# EAGLE schematic DIY_Keyboard_V1.2 (EAGLE 9.4.2)
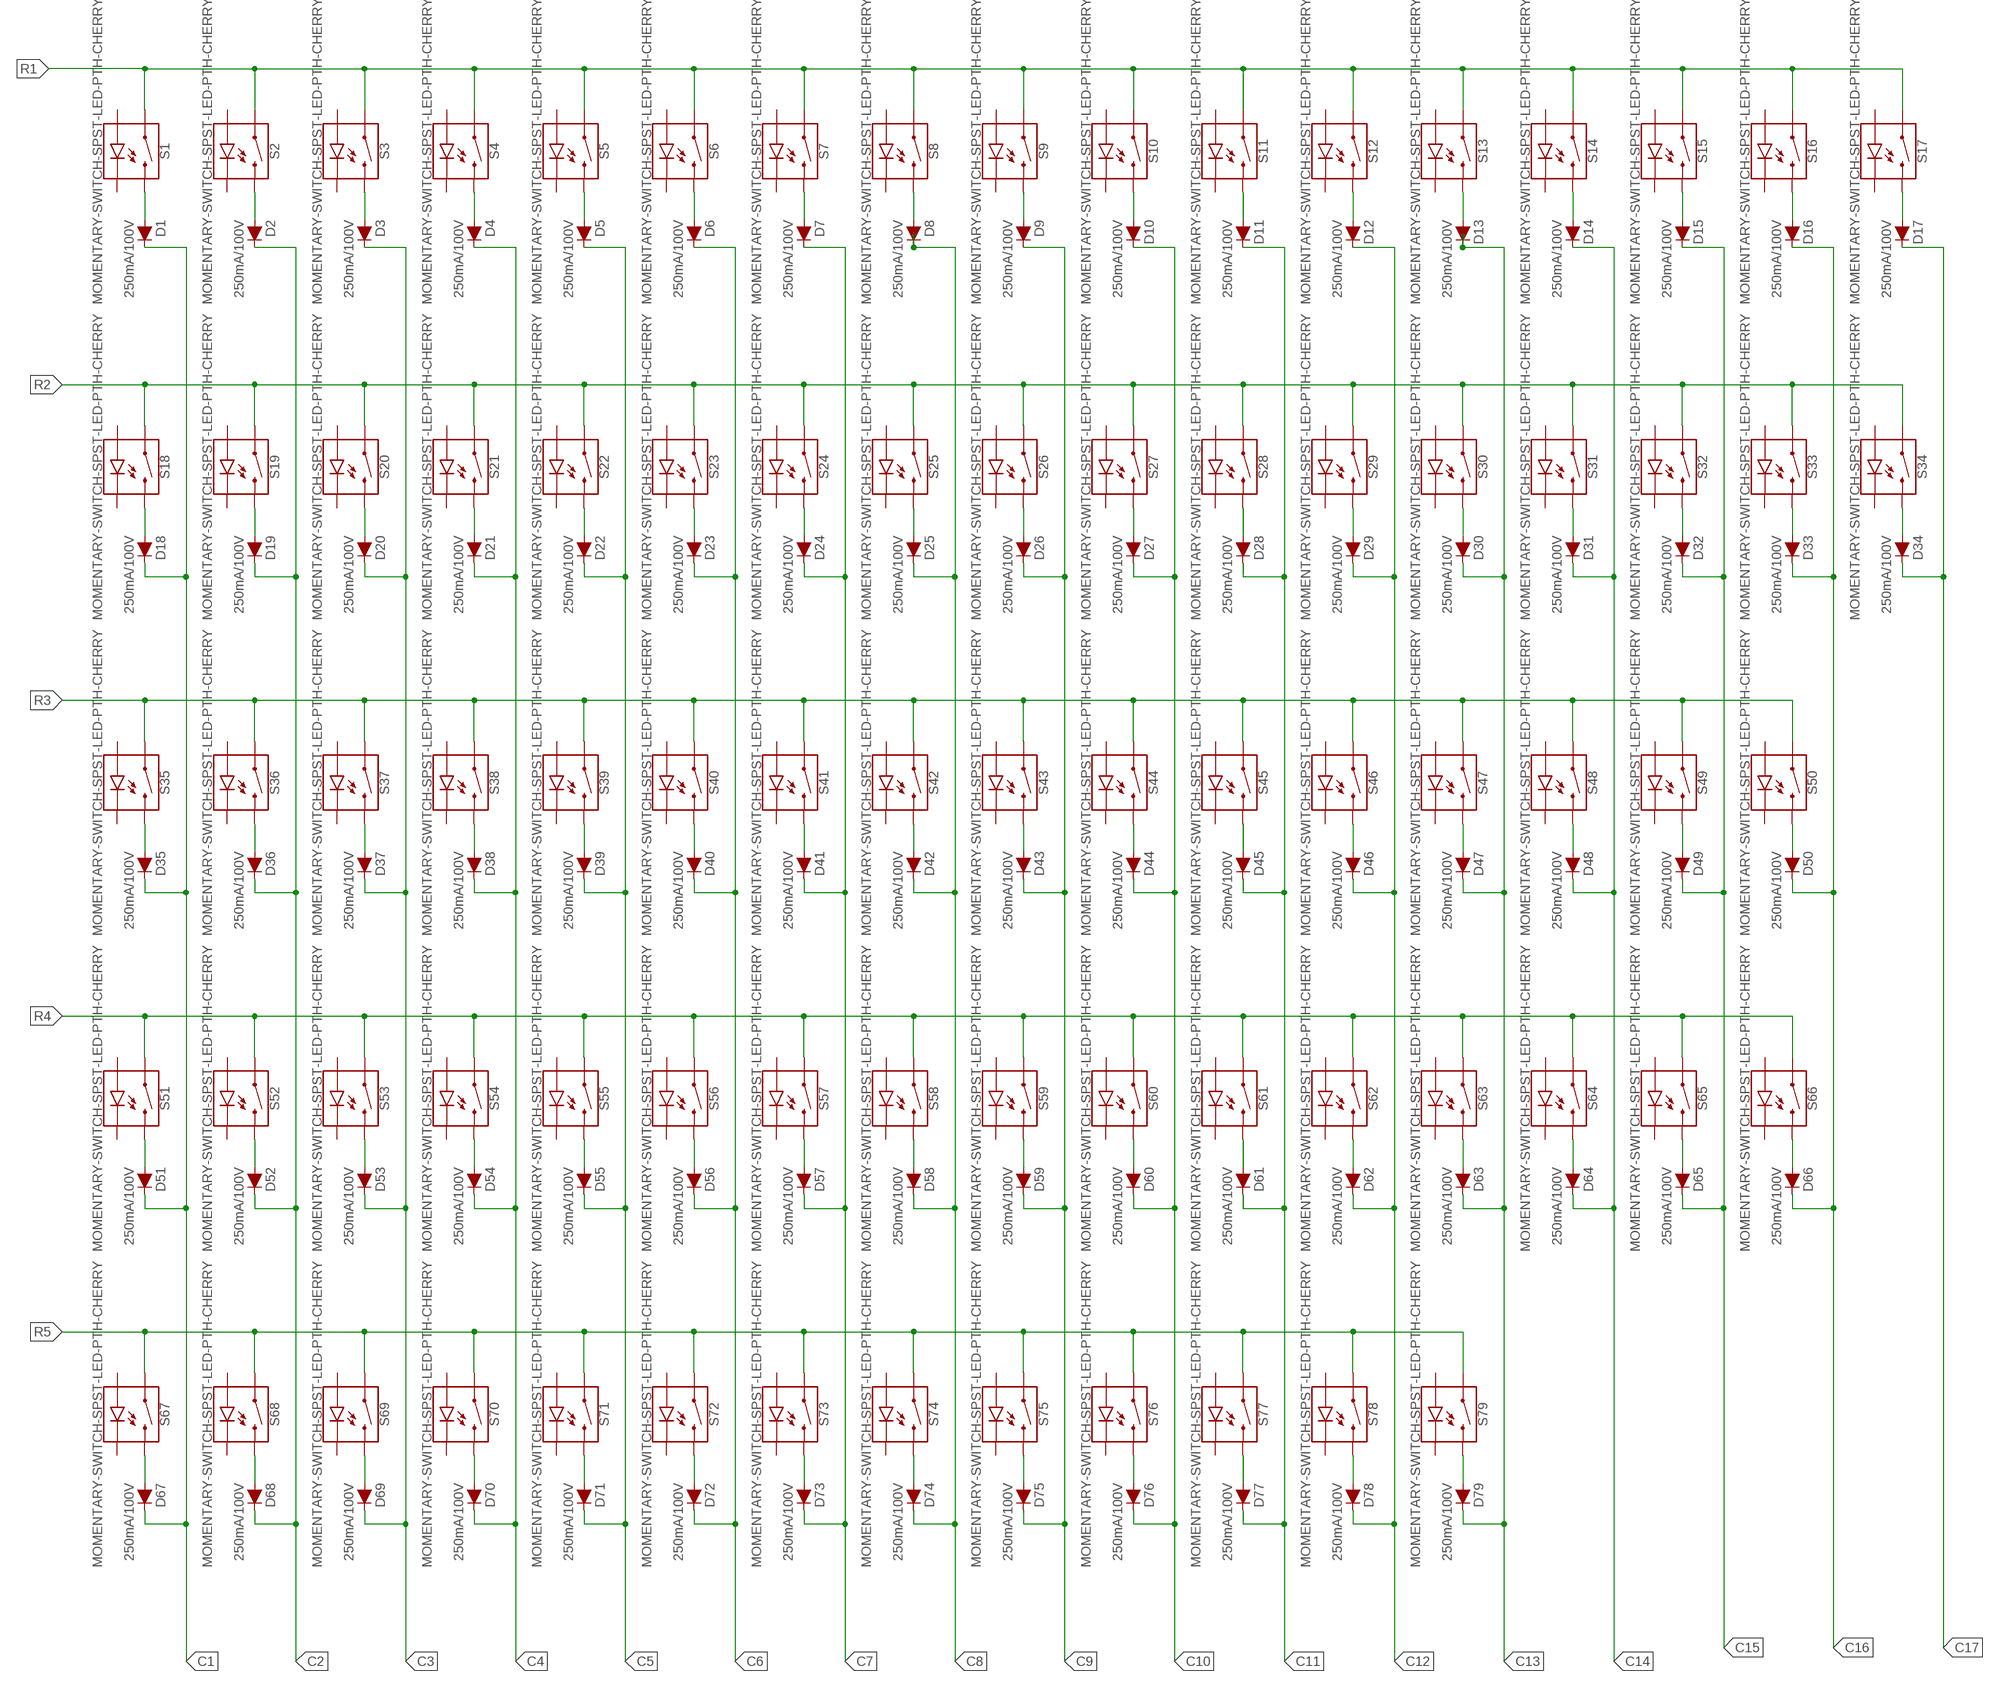
[diagram p0: schematic, sheet 1, part 1 of 2]
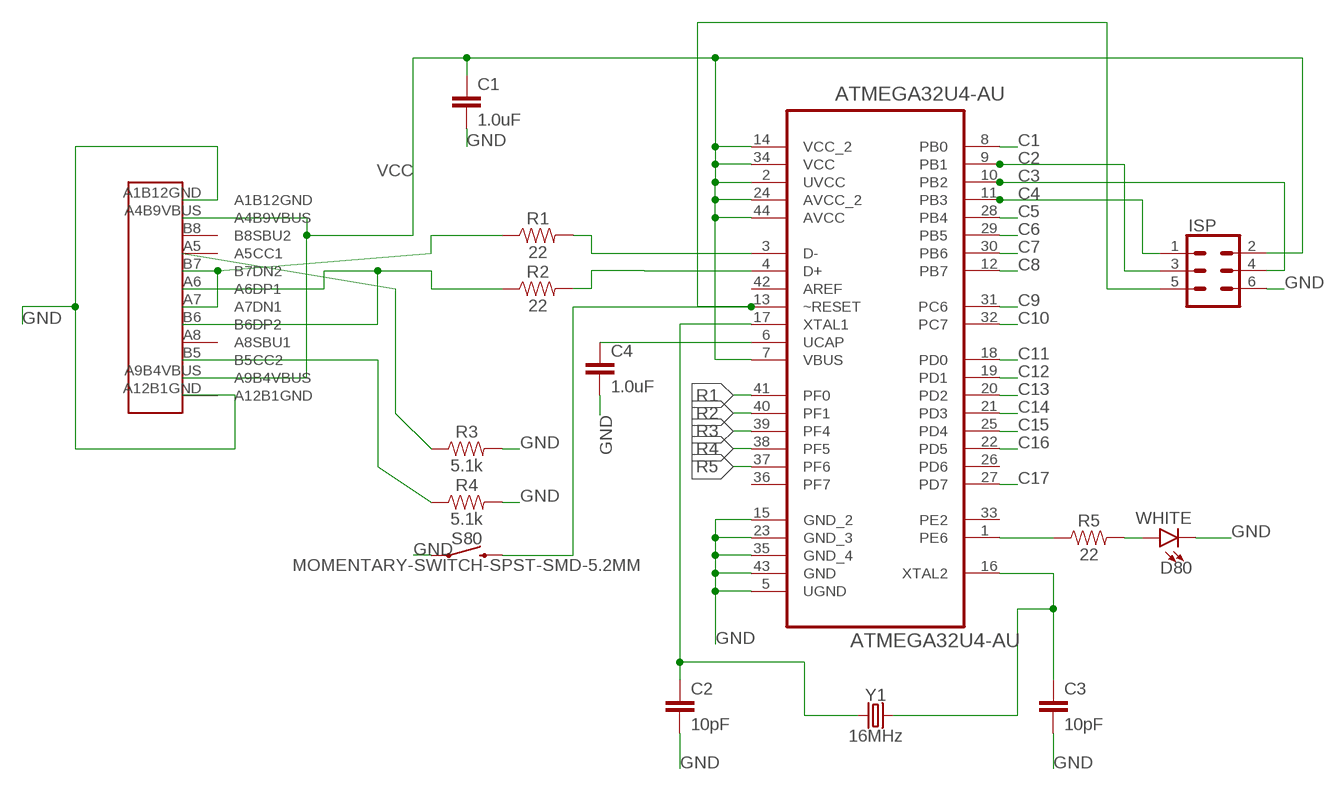
[diagram p1: schematic, sheet 1, part 2 of 2]

## Parts
ATMEGA32U4-AU  ATMEGA32U4-AU  [QFP80P1200X1200X120-44N]
C1  1.0uF  1.0UF-0603-16V-10%  [0603]
C2  10pF  10PF-0603-50V-5%  [0603]
C3  10pF  10PF-0603-50V-5%  [0603]
C4  1.0uF  1.0UF-0603-16V-10%  [0603]
D1  250mA/100V  DIODE-BAS16J  [SOD-323]
D2  250mA/100V  DIODE-BAS16J  [SOD-323]
D3  250mA/100V  DIODE-BAS16J  [SOD-323]
D4  250mA/100V  DIODE-BAS16J  [SOD-323]
D5  250mA/100V  DIODE-BAS16J  [SOD-323]
D6  250mA/100V  DIODE-BAS16J  [SOD-323]
D7  250mA/100V  DIODE-BAS16J  [SOD-323]
D8  250mA/100V  DIODE-BAS16J  [SOD-323]
D9  250mA/100V  DIODE-BAS16J  [SOD-323]
D10  250mA/100V  DIODE-BAS16J  [SOD-323]
D11  250mA/100V  DIODE-BAS16J  [SOD-323]
D12  250mA/100V  DIODE-BAS16J  [SOD-323]
D13  250mA/100V  DIODE-BAS16J  [SOD-323]
D14  250mA/100V  DIODE-BAS16J  [SOD-323]
D15  250mA/100V  DIODE-BAS16J  [SOD-323]
D16  250mA/100V  DIODE-BAS16J  [SOD-323]
D17  250mA/100V  DIODE-BAS16J  [SOD-323]
D18  250mA/100V  DIODE-BAS16J  [SOD-323]
D19  250mA/100V  DIODE-BAS16J  [SOD-323]
D20  250mA/100V  DIODE-BAS16J  [SOD-323]
D21  250mA/100V  DIODE-BAS16J  [SOD-323]
D22  250mA/100V  DIODE-BAS16J  [SOD-323]
D23  250mA/100V  DIODE-BAS16J  [SOD-323]
D24  250mA/100V  DIODE-BAS16J  [SOD-323]
D25  250mA/100V  DIODE-BAS16J  [SOD-323]
D26  250mA/100V  DIODE-BAS16J  [SOD-323]
D27  250mA/100V  DIODE-BAS16J  [SOD-323]
D28  250mA/100V  DIODE-BAS16J  [SOD-323]
D29  250mA/100V  DIODE-BAS16J  [SOD-323]
D30  250mA/100V  DIODE-BAS16J  [SOD-323]
D31  250mA/100V  DIODE-BAS16J  [SOD-323]
D32  250mA/100V  DIODE-BAS16J  [SOD-323]
D33  250mA/100V  DIODE-BAS16J  [SOD-323]
D34  250mA/100V  DIODE-BAS16J  [SOD-323]
D35  250mA/100V  DIODE-BAS16J  [SOD-323]
D36  250mA/100V  DIODE-BAS16J  [SOD-323]
D37  250mA/100V  DIODE-BAS16J  [SOD-323]
D38  250mA/100V  DIODE-BAS16J  [SOD-323]
D39  250mA/100V  DIODE-BAS16J  [SOD-323]
D40  250mA/100V  DIODE-BAS16J  [SOD-323]
D41  250mA/100V  DIODE-BAS16J  [SOD-323]
D42  250mA/100V  DIODE-BAS16J  [SOD-323]
D43  250mA/100V  DIODE-BAS16J  [SOD-323]
D44  250mA/100V  DIODE-BAS16J  [SOD-323]
D45  250mA/100V  DIODE-BAS16J  [SOD-323]
D46  250mA/100V  DIODE-BAS16J  [SOD-323]
D47  250mA/100V  DIODE-BAS16J  [SOD-323]
D48  250mA/100V  DIODE-BAS16J  [SOD-323]
D49  250mA/100V  DIODE-BAS16J  [SOD-323]
D50  250mA/100V  DIODE-BAS16J  [SOD-323]
D51  250mA/100V  DIODE-BAS16J  [SOD-323]
D52  250mA/100V  DIODE-BAS16J  [SOD-323]
D53  250mA/100V  DIODE-BAS16J  [SOD-323]
D54  250mA/100V  DIODE-BAS16J  [SOD-323]
D55  250mA/100V  DIODE-BAS16J  [SOD-323]
D56  250mA/100V  DIODE-BAS16J  [SOD-323]
D57  250mA/100V  DIODE-BAS16J  [SOD-323]
D58  250mA/100V  DIODE-BAS16J  [SOD-323]
D59  250mA/100V  DIODE-BAS16J  [SOD-323]
D60  250mA/100V  DIODE-BAS16J  [SOD-323]
D61  250mA/100V  DIODE-BAS16J  [SOD-323]
D62  250mA/100V  DIODE-BAS16J  [SOD-323]
D63  250mA/100V  DIODE-BAS16J  [SOD-323]
D64  250mA/100V  DIODE-BAS16J  [SOD-323]
D65  250mA/100V  DIODE-BAS16J  [SOD-323]
D66  250mA/100V  DIODE-BAS16J  [SOD-323]
D67  250mA/100V  DIODE-BAS16J  [SOD-323]
D68  250mA/100V  DIODE-BAS16J  [SOD-323]
D69  250mA/100V  DIODE-BAS16J  [SOD-323]
D70  250mA/100V  DIODE-BAS16J  [SOD-323]
D71  250mA/100V  DIODE-BAS16J  [SOD-323]
D72  250mA/100V  DIODE-BAS16J  [SOD-323]
D73  250mA/100V  DIODE-BAS16J  [SOD-323]
D74  250mA/100V  DIODE-BAS16J  [SOD-323]
D75  250mA/100V  DIODE-BAS16J  [SOD-323]
D76  250mA/100V  DIODE-BAS16J  [SOD-323]
D77  250mA/100V  DIODE-BAS16J  [SOD-323]
D78  250mA/100V  DIODE-BAS16J  [SOD-323]
D79  250mA/100V  DIODE-BAS16J  [SOD-323]
D80  WHITE  LED-WHITE0603  [LED-0603]
ISP  CONN_03X2FEMALE  [2X3]
R1  22  22OHM-0603-1/10W-1%  [0603]
R2  22  22OHM-0603-1/10W-1%  [0603]
R3  5.1k  56KOHM  [0603]
R4  5.1k  56KOHM  [0603]
R5  22  22OHM-0603-1/10W-1%  [0603]
S1  MOMENTARY-SWITCH-SPST-LED-PTH-CHERRY  [CHERRY-MX-LED]
S2  MOMENTARY-SWITCH-SPST-LED-PTH-CHERRY  [CHERRY-MX-LED]
S3  MOMENTARY-SWITCH-SPST-LED-PTH-CHERRY  [CHERRY-MX-LED]
S4  MOMENTARY-SWITCH-SPST-LED-PTH-CHERRY  [CHERRY-MX-LED]
S5  MOMENTARY-SWITCH-SPST-LED-PTH-CHERRY  [CHERRY-MX-LED]
S6  MOMENTARY-SWITCH-SPST-LED-PTH-CHERRY  [CHERRY-MX-LED]
S7  MOMENTARY-SWITCH-SPST-LED-PTH-CHERRY  [CHERRY-MX-LED]
S8  MOMENTARY-SWITCH-SPST-LED-PTH-CHERRY  [CHERRY-MX-LED]
S9  MOMENTARY-SWITCH-SPST-LED-PTH-CHERRY  [CHERRY-MX-LED]
S10  MOMENTARY-SWITCH-SPST-LED-PTH-CHERRY  [CHERRY-MX-LED]
S11  MOMENTARY-SWITCH-SPST-LED-PTH-CHERRY  [CHERRY-MX-LED]
S12  MOMENTARY-SWITCH-SPST-LED-PTH-CHERRY  [CHERRY-MX-LED]
S13  MOMENTARY-SWITCH-SPST-LED-PTH-CHERRY  [CHERRY-MX-LED]
S14  MOMENTARY-SWITCH-SPST-LED-PTH-CHERRY  [CHERRY-MX-LED]
S15  MOMENTARY-SWITCH-SPST-LED-PTH-CHERRY  [CHERRY-MX-LED]
S16  MOMENTARY-SWITCH-SPST-LED-PTH-CHERRY  [CHERRY-MX-LED]
S17  MOMENTARY-SWITCH-SPST-LED-PTH-CHERRY  [CHERRY-MX-LED]
S18  MOMENTARY-SWITCH-SPST-LED-PTH-CHERRY  [CHERRY-MX-LED]
S19  MOMENTARY-SWITCH-SPST-LED-PTH-CHERRY  [CHERRY-MX-LED]
S20  MOMENTARY-SWITCH-SPST-LED-PTH-CHERRY  [CHERRY-MX-LED]
S21  MOMENTARY-SWITCH-SPST-LED-PTH-CHERRY  [CHERRY-MX-LED]
S22  MOMENTARY-SWITCH-SPST-LED-PTH-CHERRY  [CHERRY-MX-LED]
S23  MOMENTARY-SWITCH-SPST-LED-PTH-CHERRY  [CHERRY-MX-LED]
S24  MOMENTARY-SWITCH-SPST-LED-PTH-CHERRY  [CHERRY-MX-LED]
S25  MOMENTARY-SWITCH-SPST-LED-PTH-CHERRY  [CHERRY-MX-LED]
S26  MOMENTARY-SWITCH-SPST-LED-PTH-CHERRY  [CHERRY-MX-LED]
S27  MOMENTARY-SWITCH-SPST-LED-PTH-CHERRY  [CHERRY-MX-LED]
S28  MOMENTARY-SWITCH-SPST-LED-PTH-CHERRY  [CHERRY-MX-LED]
S29  MOMENTARY-SWITCH-SPST-LED-PTH-CHERRY  [CHERRY-MX-LED]
S30  MOMENTARY-SWITCH-SPST-LED-PTH-CHERRY  [CHERRY-MX-LED]
S31  MOMENTARY-SWITCH-SPST-LED-PTH-CHERRY  [CHERRY-MX-LED]
S32  MOMENTARY-SWITCH-SPST-LED-PTH-CHERRY  [CHERRY-MX-LED]
S33  MOMENTARY-SWITCH-SPST-LED-PTH-CHERRY  [CHERRY-MX-LED]
S34  MOMENTARY-SWITCH-SPST-LED-PTH-CHERRY  [CHERRY-MX-LED]
S35  MOMENTARY-SWITCH-SPST-LED-PTH-CHERRY  [CHERRY-MX-LED]
S36  MOMENTARY-SWITCH-SPST-LED-PTH-CHERRY  [CHERRY-MX-LED]
S37  MOMENTARY-SWITCH-SPST-LED-PTH-CHERRY  [CHERRY-MX-LED]
S38  MOMENTARY-SWITCH-SPST-LED-PTH-CHERRY  [CHERRY-MX-LED]
S39  MOMENTARY-SWITCH-SPST-LED-PTH-CHERRY  [CHERRY-MX-LED]
S40  MOMENTARY-SWITCH-SPST-LED-PTH-CHERRY  [CHERRY-MX-LED]
S41  MOMENTARY-SWITCH-SPST-LED-PTH-CHERRY  [CHERRY-MX-LED]
S42  MOMENTARY-SWITCH-SPST-LED-PTH-CHERRY  [CHERRY-MX-LED]
S43  MOMENTARY-SWITCH-SPST-LED-PTH-CHERRY  [CHERRY-MX-LED]
S44  MOMENTARY-SWITCH-SPST-LED-PTH-CHERRY  [CHERRY-MX-LED]
S45  MOMENTARY-SWITCH-SPST-LED-PTH-CHERRY  [CHERRY-MX-LED]
S46  MOMENTARY-SWITCH-SPST-LED-PTH-CHERRY  [CHERRY-MX-LED]
S47  MOMENTARY-SWITCH-SPST-LED-PTH-CHERRY  [CHERRY-MX-LED]
S48  MOMENTARY-SWITCH-SPST-LED-PTH-CHERRY  [CHERRY-MX-LED]
S49  MOMENTARY-SWITCH-SPST-LED-PTH-CHERRY  [CHERRY-MX-LED]
S50  MOMENTARY-SWITCH-SPST-LED-PTH-CHERRY  [CHERRY-MX-LED]
S51  MOMENTARY-SWITCH-SPST-LED-PTH-CHERRY  [CHERRY-MX-LED]
S52  MOMENTARY-SWITCH-SPST-LED-PTH-CHERRY  [CHERRY-MX-LED]
S53  MOMENTARY-SWITCH-SPST-LED-PTH-CHERRY  [CHERRY-MX-LED]
S54  MOMENTARY-SWITCH-SPST-LED-PTH-CHERRY  [CHERRY-MX-LED]
S55  MOMENTARY-SWITCH-SPST-LED-PTH-CHERRY  [CHERRY-MX-LED]
S56  MOMENTARY-SWITCH-SPST-LED-PTH-CHERRY  [CHERRY-MX-LED]
S57  MOMENTARY-SWITCH-SPST-LED-PTH-CHERRY  [CHERRY-MX-LED]
S58  MOMENTARY-SWITCH-SPST-LED-PTH-CHERRY  [CHERRY-MX-LED]
S59  MOMENTARY-SWITCH-SPST-LED-PTH-CHERRY  [CHERRY-MX-LED]
S60  MOMENTARY-SWITCH-SPST-LED-PTH-CHERRY  [CHERRY-MX-LED]
S61  MOMENTARY-SWITCH-SPST-LED-PTH-CHERRY  [CHERRY-MX-LED]
S62  MOMENTARY-SWITCH-SPST-LED-PTH-CHERRY  [CHERRY-MX-LED]
S63  MOMENTARY-SWITCH-SPST-LED-PTH-CHERRY  [CHERRY-MX-LED]
S64  MOMENTARY-SWITCH-SPST-LED-PTH-CHERRY  [CHERRY-MX-LED]
S65  MOMENTARY-SWITCH-SPST-LED-PTH-CHERRY  [CHERRY-MX-LED]
S66  MOMENTARY-SWITCH-SPST-LED-PTH-CHERRY  [CHERRY-MX-LED]
S67  MOMENTARY-SWITCH-SPST-LED-PTH-CHERRY  [CHERRY-MX-LED]
S68  MOMENTARY-SWITCH-SPST-LED-PTH-CHERRY  [CHERRY-MX-LED]
S69  MOMENTARY-SWITCH-SPST-LED-PTH-CHERRY  [CHERRY-MX-LED]
S70  MOMENTARY-SWITCH-SPST-LED-PTH-CHERRY  [CHERRY-MX-LED]
S71  MOMENTARY-SWITCH-SPST-LED-PTH-CHERRY  [CHERRY-MX-LED]
S72  MOMENTARY-SWITCH-SPST-LED-PTH-CHERRY  [CHERRY-MX-LED]
S73  MOMENTARY-SWITCH-SPST-LED-PTH-CHERRY  [CHERRY-MX-LED]
S74  MOMENTARY-SWITCH-SPST-LED-PTH-CHERRY  [CHERRY-MX-LED]
S75  MOMENTARY-SWITCH-SPST-LED-PTH-CHERRY  [CHERRY-MX-LED]
S76  MOMENTARY-SWITCH-SPST-LED-PTH-CHERRY  [CHERRY-MX-LED]
S77  MOMENTARY-SWITCH-SPST-LED-PTH-CHERRY  [CHERRY-MX-LED]
S78  MOMENTARY-SWITCH-SPST-LED-PTH-CHERRY  [CHERRY-MX-LED]
S79  MOMENTARY-SWITCH-SPST-LED-PTH-CHERRY  [CHERRY-MX-LED]
S80  MOMENTARY-SWITCH-SPST-SMD-5.2MM  [TACTILE_SWITCH_SMD_5.2MM]
U$1  USB_TYPE_C  [USB_TYPE_C]
Y1  16MHz  CRYSTAL-16MHZSMD-5X3.2  [CRYSTAL-SMD-5X3.2-4PAD]

## Nets
C1: ATMEGA32U4-AU.8(PB0) D1.C D18.C D35.C D51.C D67.C
C2: ATMEGA32U4-AU.9(PB1) D2.C D19.C D36.C D52.C D68.C ISP.3
C3: ATMEGA32U4-AU.10(PB2) D3.C D20.C D37.C D53.C D69.C ISP.4
C4: ATMEGA32U4-AU.11(PB3) D4.C D21.C D38.C D54.C D70.C ISP.1
C5: ATMEGA32U4-AU.28(PB4) D5.C D22.C D39.C D55.C D71.C
C6: ATMEGA32U4-AU.29(PB5) D6.C D23.C D40.C D56.C D72.C
C7: ATMEGA32U4-AU.30(PB6) D7.C D24.C D41.C D57.C D73.C
C8: ATMEGA32U4-AU.12(PB7) D8.C D25.C D42.C D58.C D74.C
C9: ATMEGA32U4-AU.31(PC6) D9.C D26.C D43.C D59.C D75.C
C10: ATMEGA32U4-AU.32(PC7) D10.C D27.C D44.C D60.C D76.C
C11: ATMEGA32U4-AU.18(PD0) D11.C D28.C D45.C D61.C D77.C
C12: ATMEGA32U4-AU.19(PD1) D12.C D29.C D46.C D62.C D78.C
C13: ATMEGA32U4-AU.20(PD2) D13.C D30.C D47.C D63.C D79.C
C14: ATMEGA32U4-AU.21(PD3) D14.C D31.C D48.C D64.C
C15: ATMEGA32U4-AU.25(PD4) D15.C D32.C D49.C D65.C
C16: ATMEGA32U4-AU.22(PD5) D16.C D33.C D50.C D66.C
C17: ATMEGA32U4-AU.27(PD7) D17.C D34.C
GND: ATMEGA32U4-AU.5(UGND) ATMEGA32U4-AU.15(GND_2) ATMEGA32U4-AU.23(GND_3) ATMEGA32U4-AU.35(GND_4) ATMEGA32U4-AU.43(GND) C1.2 C2.2 C3.2 C4.2 D80.C ISP.6 R3.2 R4.2 S80.1 U$1.A1B12GND U$1.A12B1GND
N$1: D1.A S1.S2
N$2: D2.A S2.S2
N$3: D3.A S3.S2
N$4: D4.A S4.S2
N$5: D5.A S5.S2
N$6: D6.A S6.S2
N$7: D7.A S7.S2
N$8: D8.A S8.S2
N$9: D9.A S9.S2
N$10: D10.A S10.S2
N$11: D11.A S11.S2
N$12: D12.A S12.S2
N$13: D13.A S13.S2
N$14: D14.A S14.S2
N$15: D15.A S15.S2
N$16: D16.A S16.S2
N$17: D17.A S17.S2
N$18: D18.A S18.S2
N$19: D19.A S19.S2
N$20: D20.A S20.S2
N$21: D21.A S21.S2
N$22: D22.A S22.S2
N$23: D23.A S23.S2
N$24: D24.A S24.S2
N$25: D25.A S25.S2
N$26: D26.A S26.S2
N$27: D27.A S27.S2
N$28: D28.A S28.S2
N$29: D29.A S29.S2
N$30: D30.A S30.S2
N$31: D31.A S31.S2
N$32: D32.A S32.S2
N$33: D33.A S33.S2
N$34: D34.A S34.S2
N$35: D35.A S35.S2
N$36: D36.A S36.S2
N$37: D37.A S37.S2
N$38: D38.A S38.S2
N$39: D39.A S39.S2
N$40: D40.A S40.S2
N$41: D41.A S41.S2
N$42: D42.A S42.S2
N$43: D43.A S43.S2
N$44: D44.A S44.S2
N$45: D45.A S45.S2
N$46: D46.A S46.S2
N$47: D47.A S47.S2
N$48: D48.A S48.S2
N$49: D49.A S49.S2
N$50: D50.A S50.S2
N$51: D51.A S51.S2
N$52: D52.A S52.S2
N$53: D53.A S53.S2
N$54: D54.A S54.S2
N$55: D55.A S55.S2
N$56: D56.A S56.S2
N$57: D57.A S57.S2
N$58: D58.A S58.S2
N$59: D59.A S59.S2
N$60: D60.A S60.S2
N$61: D61.A S61.S2
N$62: D62.A S62.S2
N$63: D63.A S63.S2
N$64: D64.A S64.S2
N$65: D65.A S65.S2
N$66: D66.A S66.S2
N$67: D67.A S67.S2
N$68: D68.A S68.S2
N$69: D69.A S69.S2
N$70: D70.A S70.S2
N$71: D71.A S71.S2
N$72: D72.A S72.S2
N$73: D73.A S73.S2
N$74: D74.A S74.S2
N$75: D75.A S75.S2
N$76: D76.A S76.S2
N$77: D77.A S77.S2
N$78: D78.A S78.S2
N$79: D79.A S79.S2
N$80: ATMEGA32U4-AU.3(D-) R1.2
N$81: ATMEGA32U4-AU.4(D+) R2.2
N$82: R1.1 U$1.A7(A7DN1) U$1.B7(B7DN2)
N$84: R2.1 U$1.A6(A6DP1) U$1.B6(B6DP2)
N$85: ATMEGA32U4-AU.13(~RESET) ISP.5 S80.3
N$86: ATMEGA32U4-AU.16(XTAL2) C3.1 Y1.3
N$87: ATMEGA32U4-AU.17(XTAL1) C2.1 Y1.1
N$88: R3.1 U$1.A5(A5CC1)
N$89: R4.1 U$1.B5(B5CC2)
N$90: ATMEGA32U4-AU.1(PE6) R5.1
N$91: D80.A R5.2
N$92: ATMEGA32U4-AU.6(UCAP) C4.1
R1: ATMEGA32U4-AU.41(PF0) S1.S1 S2.S1 S3.S1 S4.S1 S5.S1 S6.S1 S7.S1 S8.S1 S9.S1 S10.S1 S11.S1 S12.S1 S13.S1 S14.S1 S15.S1 S16.S1 S17.S1
R2: ATMEGA32U4-AU.40(PF1) S18.S1 S19.S1 S20.S1 S21.S1 S22.S1 S23.S1 S24.S1 S25.S1 S26.S1 S27.S1 S28.S1 S29.S1 S30.S1 S31.S1 S32.S1 S33.S1 S34.S1
R3: ATMEGA32U4-AU.39(PF4) S35.S1 S36.S1 S37.S1 S38.S1 S39.S1 S40.S1 S41.S1 S42.S1 S43.S1 S44.S1 S45.S1 S46.S1 S47.S1 S48.S1 S49.S1 S50.S1
R4: ATMEGA32U4-AU.38(PF5) S51.S1 S52.S1 S53.S1 S54.S1 S55.S1 S56.S1 S57.S1 S58.S1 S59.S1 S60.S1 S61.S1 S62.S1 S63.S1 S64.S1 S65.S1 S66.S1
R5: ATMEGA32U4-AU.37(PF6) S67.S1 S68.S1 S69.S1 S70.S1 S71.S1 S72.S1 S73.S1 S74.S1 S75.S1 S76.S1 S77.S1 S78.S1 S79.S1
VCC: ATMEGA32U4-AU.2(UVCC) ATMEGA32U4-AU.7(VBUS) ATMEGA32U4-AU.14(VCC_2) ATMEGA32U4-AU.24(AVCC_2) ATMEGA32U4-AU.34(VCC) ATMEGA32U4-AU.44(AVCC) C1.1 ISP.2 U$1.A4B9VBUS U$1.A9B4VBUS
Unconnected: ATMEGA32U4-AU.26(PD6) ATMEGA32U4-AU.33(PE2) ATMEGA32U4-AU.36(PF7) ATMEGA32U4-AU.42(AREF) S1.A S1.K(C) S2.A S2.K(C) S3.A S3.K(C) S4.A S4.K(C) S5.A S5.K(C) S6.A S6.K(C) S7.A S7.K(C) S8.A S8.K(C) S9.A S9.K(C) S10.A S10.K(C) S11.A S11.K(C) S12.A S12.K(C) S13.A S13.K(C) S14.A S14.K(C) S15.A S15.K(C) S16.A S16.K(C) S17.A S17.K(C) S18.A S18.K(C) S19.A S19.K(C) S20.A S20.K(C) S21.A S21.K(C) S22.A S22.K(C) S23.A S23.K(C) S24.A S24.K(C) S25.A S25.K(C) S26.A S26.K(C) S27.A S27.K(C) S28.A S28.K(C) S29.A S29.K(C) S30.A S30.K(C) S31.A S31.K(C) S32.A S32.K(C) S33.A S33.K(C) S34.A S34.K(C) S35.A S35.K(C) S36.A S36.K(C) S37.A S37.K(C) S38.A S38.K(C) S39.A S39.K(C) S40.A S40.K(C) S41.A S41.K(C) S42.A S42.K(C) S43.A S43.K(C) S44.A S44.K(C) S45.A S45.K(C) S46.A S46.K(C) S47.A S47.K(C) S48.A S48.K(C) S49.A S49.K(C) S50.A S50.K(C) S51.A S51.K(C) S52.A S52.K(C) S53.A S53.K(C) S54.A S54.K(C) S55.A S55.K(C) S56.A S56.K(C) S57.A S57.K(C) S58.A S58.K(C) S59.A S59.K(C) S60.A S60.K(C) S61.A S61.K(C) S62.A S62.K(C) S63.A S63.K(C) S64.A S64.K(C) S65.A S65.K(C) S66.A S66.K(C) S67.A S67.K(C) S68.A S68.K(C) S69.A S69.K(C) S70.A S70.K(C) S71.A S71.K(C) S72.A S72.K(C) S73.A S73.K(C) S74.A S74.K(C) S75.A S75.K(C) S76.A S76.K(C) S77.A S77.K(C) S78.A S78.K(C) S79.A S79.K(C) U$1.A8(A8SBU1) U$1.B8(B8SBU2)

## Library data of the parts
ATMEGA32U4-AU = ATMEGA32U4-AU:ATMEGA32U4-AU: 8-bit Microcontroller with ISP Flash and USB Controller; AVAILABILITY: Unavailable; DESCRIPTION: MCU 8-bit ATmega AVR RISC 32KB Flash 3.3V/5V 44-Pin TQFP; MF: Microchip; MP: ATMEGA32U4-AU; PACKAGE: TQFP-44 Microchip; PRICE: None
C1 C4 = SparkFun-Capacitors:1.0UF: 1µF ceramic capacitors A capacitor is a passive two-terminal electrical component used to store electrical energy temporarily in an electric field.; PROD_ID: CAP-00868
C2 C3 = SparkFun-Capacitors:10PF: 10pF ceramic capacitors A capacitor is a passive two-terminal electrical component used to store electrical energy temporarily in an electric field.; PROD_ID: CAP-11812
D1-D79 = SparkFun-DiscreteSemi:DIODE: Diode These are standard reverse protection diodes and small signal diodes. SparkFun Products: SparkFun SparkPunk Sound Kit <https://www.sparkfun.com/products/11177> SparkFun ESP8266 Thing <https://www.sparkfun.com/products/13231>; PROD_ID: DIO-09646
D80 = SparkFun-LED:LED-WHITE: White SMD LED Used in manufacturing several products at SparkFun. Packages: 0603 - Bright White SMD 0603 package[Product Link] <http://www.kingbrightusa.com/product.asp?catalog_name=LED&product_id=APT1608QWF/D> 1206 - Bright White SMD1206 package [Product Link] <http://www.kingbrightusa.com/product.asp?catalog_name=LED&product_id=APT3216QWF/D> 3014 - Super Bright SMD 3014 package [Datasheet] <http://www.lumileds.com/uploads/459/DS208-pdf> SparkFun Products: Blackberry Trackballer Breakout <https://www.sparkfun.com/products/13169> Digital SandBox <https://www.sparkfun.com/products/12651>; PROD_ID: DIO-09004
ISP = SparkFun-Connectors:CONN_03X2: Multi connection point. Often used as Generic Header-pin footprint for 0.1 inch spaced/style header connections You can populate with any combo of single row headers, but if you'd like an exact match, check these: Header - 2x3 (Male, 0.1") <https://www.sparkfun.com/products/12807> (PRT-12807) Header - 2x3 (Female, 0.1") <https://www.sparkfun.com/products/13010> (PRT-13010) 2x3 Pin Shrouded Header <https://www.sparkfun.com/products/10877> (PRT-10877) On any of the 0.1 inch spaced packages, you can populate with these: Break Away Headers - Straight <https://www.sparkfun.com/products/116> (PRT-00116) Break Away Male Headers - Right Angle <https://www.sparkfun.com/products/553> (PRT-00553) Female Headers <https://www.sparkfun.com/products/115> (PRT-00115) Break Away Headers - Machine Pin <https://www.sparkfun.com/products/117> (PRT-00117) Break Away Female Headers - Swiss Machine Pin <https://www.sparkfun.com/products/743> (PRT-00743) Special note: the shrouded connector mates well with our 3x2 ribbon cables: Ribbon Crimp Connector - 6-pin (2x3, Female) <https://www.sparkfun.com/products/10651> (PRT-10651) Ribbon Cable - 6 wire (15ft) <https://www.sparkfun.com/products/10646> (PRT-10646); PROD_ID: CONN-11566; VALUE: FEMALE 2x3
R1 R2 R5 = SparkFun-Resistors:22OHM: 22Ω resistor A resistor is a passive two-terminal electrical component that implements electrical resistance as a circuit element. Resistors act to reduce current flow, and, at the same time, act to lower voltage levels within circuits. - Wikipedia; PROD_ID: RES-08698
R3 R4 = SparkFun-Resistors:56KOHM; VALUE: 56k
S1-S79 = SparkFun-Switches:MOMENTARY-SWITCH-SPST-LED: Momentary Switch (Pushbutton) - SPST - w/ LED Normally-open (NO) SPST momentary switches (buttons, pushbuttons), with a built-in LED. Variants PTH-CHERRY - Cherry MX Switch Cherry MX Keyswitches are top-of-the-line mechanical keyboard switches. They’re satisfyingly “clicky”, reliable up to tens-of-millions of key presses, and a standard in gaming and programming keyboards across the globe. This ‘blue’ version Cherry MX Switch is favored by most due to its secondary internal actuator making it less likely to “double-tap.” If you are looking for a noticeably audible and high-quality key switch, this is the perfect option for you! Cherry MX Switch <https://www.sparkfun.com/products/13834> (COM-13834) Cherry MX Switch Breakout <https://www.sparkfun.com/products/13773> (BOB-13773) PTH-12MM and PTH-12MM-KIT - 12mm Illuminated LED KIT variant is for soldering kits. There is no tStop (covering up the top side of the pads with mask). This helps the beginner see which side they should be soldering too. LED Tactile Button Breakout <https://www.sparkfun.com/products/10467> (BOB-10467) LED Tactile Button - Red <https://www.sparkfun.com/products/10442> (COM-10442) LED Tactile Button - Blue <https://www.sparkfun.com/products/10443> (COM-10443) LED Tactile Button - Green <https://www.sparkfun.com/products/10440> (COM-10440) LED Tactile Button - Orange <https://www.sparkfun.com/products/10441> (COM-10441) LED Tactile Button - White <https://www.sparkfun.com/products/10439> (COM-10439); SF_ID: COM-13834
S80 = SparkFun-Switches:MOMENTARY-SWITCH-SPST: Momentary Switch (Pushbutton) - SPST Normally-open (NO) SPST momentary switches (buttons, pushbuttons). Variants PTH-12MM - 12mm square, through-hole Momentary Pushbutton Switch - 12mm Square <https://www.sparkfun.com/products/9190> (COM-09190) PTH-6.0MM, PTH-6.0MM-KIT - 6.0mm square, through-hole Mini Pushbutton Switch <https://www.sparkfun.com/products/97> (COM-00097) KIT package intended for soldering kit's - only one side of pads' copper is exposed. PTH-RIGHT-ANGLE-KIT - Right-angle, through-hole Right Angle Tactile Button <https://www.sparkfun.com/products/10791> - Used on SparkFun BigTime Watch Kit <https://www.sparkfun.com/products/11734> SMD-12MM - 12mm square, surface-mount Tactile Button - SMD (12mm) <https://www.sparkfun.com/products/12993> (COM-12993) Used on SparkFun PicoBoard <https://www.sparkfun.com/products/11888> SMD-4.5MM - 4.5mm Square Trackball Switch Used on SparkFun Blackberry Trackballer Breakout <https://www.sparkfun.com/products/13169> SMD-4.6MMX2.8MM - 4.60mm x 2.80mm, surface mount Used on SparkFun SAMD21 Mini Breakout <https://www.sparkfun.com/products/13664> SMD-5.2MM, SMD-5.2-REDUNDANT - 5.2mm square, surface-mount Mini Pushbutton Switch - SMD <https://www.sparkfun.com/products/8720> (COM-08720) Used on Arduino Pro Mini <https://www.sparkfun.com/products/11114> REDUNDANT package connects both switch circuits together SMD-6.0X3.5MM - 6.0 x 3.5mm, surface mount Momentary Reset Switch SMD <https://www.sparkfun.com/products/8229> (COM-08229) SMD-6.2MM-TALL - 6.2mm square, surface mount Tactile Button - SMD (6mm) <https://www.sparkfun.com/products/12992> Used on SparkFun Digital Sandbox <https://www.sparkfun.com/products/12651> SMD-RIGHT-ANGLE - Right-angle, surface mount Used on SparkFun Block for Intel® Edison - Arduino <https://www.sparkfun.com/products/13036>; PROD_ID: SWCH-08247; SF_SKU: COM-08720
U$1 = USB-TYPE-C-V2:USB_TYPE_C
Y1 = SparkFun-Clocks:CRYSTAL-16MHZ: 16MHz Crystal Digikey Example <http://www.digikey.com/product-search/en?keywords=535-9122-1-ND> Frequency: 16MHz Frequency Stability: ±50ppm Frequency Tolerance: ±20ppm Load Capacitance: 18pF SparkFun Products: Pro Micro -5V/16MHz <https://www.sparkfun.com/products/12640> SparkFun Serial Enabled LCD Kit <https://www.sparkfun.com/products/10097>; PROD_ID: XTAL-08218; SF_ID: COM-00094